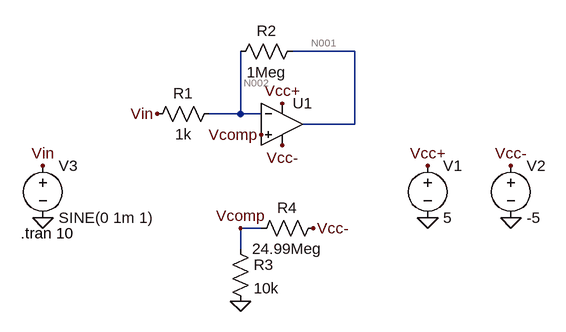
[diagram p0: schematic Draft1.asc]
Draft1.asc, the LTspice schematic file:
Version 4
SHEET 1 880 680
WIRE 336 48 240 48
WIRE 160 144 160 48
WIRE 160 144 112 144
WIRE 192 144 160 144
WIRE 336 160 336 48
WIRE 336 160 256 160
WIRE 192 320 160 320
WIRE 160 352 160 320
FLAG 448 304 0
FLAG 448 224 Vcc+
FLAG 224 128 Vcc+
FLAG 576 304 0
FLAG 576 224 Vcc-
FLAG 224 192 Vcc-
FLAG -144 304 0
FLAG -144 224 Vin
FLAG 32 144 Vin
FLAG 160 432 0
FLAG 160 320 Vcomp
FLAG 272 320 Vcc-
FLAG 192 176 Vcomp
SYMBOL res 128 128 R90
WINDOW 0 0 56 VBottom 2
WINDOW 3 32 56 VTop 2
SYMATTR InstName R1
SYMATTR Value 1k
SYMBOL res 256 32 R90
WINDOW 0 0 56 VBottom 2
WINDOW 3 32 56 VTop 2
SYMATTR InstName R2
SYMATTR Value 1Meg
SYMBOL voltage 448 208 R0
WINDOW 123 0 0 Left 0
WINDOW 39 0 0 Left 0
SYMATTR InstName V1
SYMATTR Value 5
SYMBOL OpAmps\\UniversalOpAmp2 224 160 R0
SYMATTR InstName U1
SYMATTR SpiceLine Ilimit=25m Rail=0 Vos=2m
SYMBOL voltage 576 208 R0
WINDOW 123 0 0 Left 0
WINDOW 39 0 0 Left 0
SYMATTR InstName V2
SYMATTR Value -5
SYMBOL voltage -144 208 R0
WINDOW 123 0 0 Left 0
WINDOW 39 0 0 Left 0
SYMATTR InstName V3
SYMATTR Value SINE(0 1m 1)
SYMBOL res 144 336 R0
SYMATTR InstName R3
SYMATTR Value 10k
SYMBOL res 288 304 R90
WINDOW 0 0 56 VBottom 2
WINDOW 3 32 56 VTop 2
SYMATTR InstName R4
SYMATTR Value 24.99Meg
TEXT -178 328 Left 2 !.tran 10

The netlist it stands for:
* Draft1.asc
R1 N002 Vin 1k
R2 N001 N002 1Meg
V1 Vcc+ 0 5
XU1 Vcomp N002 Vcc+ Vcc- N001 level2 Avol=1Meg GBW=10Meg Slew=10Meg Ilimit=25m Rail=0 Vos=2m En=0 Enk=0 In=0 Ink=0 Rin=500Meg  ; pins In+ In- V+ V- OUT
V2 Vcc- 0 -5
V3 Vin 0 SINE(0 1m 1)
R3 Vcomp 0 10k
R4 Vcc- Vcomp 24.99Meg
.tran 10
.lib UniversalOpAmp2.lib
.backanno
.end

* Results of the author's LTspice run, read from the files saved beside the schematic
* Operating Point, zero values left out:
*   V(n002) = 39.94 nV
*   V(n001) = 39.98 µV
*   V(vcc+) = 5 V
*   V(vcc-) = -5 V
*   V(vcomp) = -2 mV
*   I(R1) = 39.94 pA
*   I(R2) = 39.94 pA
*   I(R3) = -200 nA
*   I(R4) = -200 nA
*   I(V1) = -500 µA
*   I(V2) = 500.2 µA
*   I(V3) = 39.94 pA
*   Ix(u1:1) = -4 pA
*   Ix(u1:3) = 500 µA
*   Ix(u1:4) = -500 µA
*   Ix(u1:5) = -39.94 pA
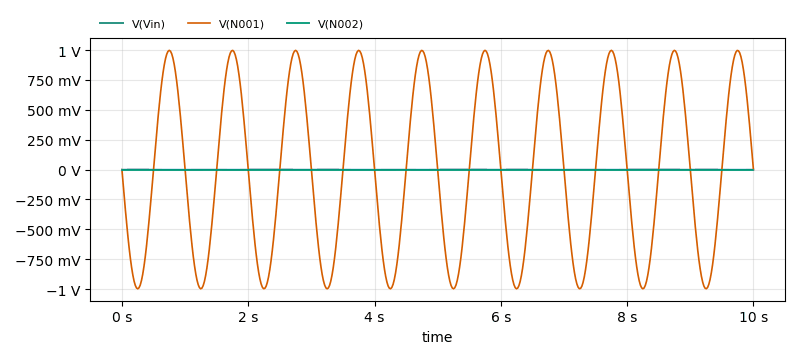
[diagram p1: Transient Analysis of Draft1.asc, plotted from the saved traces]
* Transient Analysis, 1 run:
*   V(Vin): min -1 mV, max 1 mV, average 0 V, rms 707.2 µV, last 0 V
*   V(N001): min -998 mV, max 998.1 mV, average 39.94 µV, rms 705.8 mV, last 140.3 µV
*   V(N002): min -967.8 nV, max 1.048 µV, average 39.94 nV, rms 713.8 nV, last 140.2 nV